# EAGLE design PowerModule_Testboard (EAGLE 9.6.2)
Assembly variants: DVT
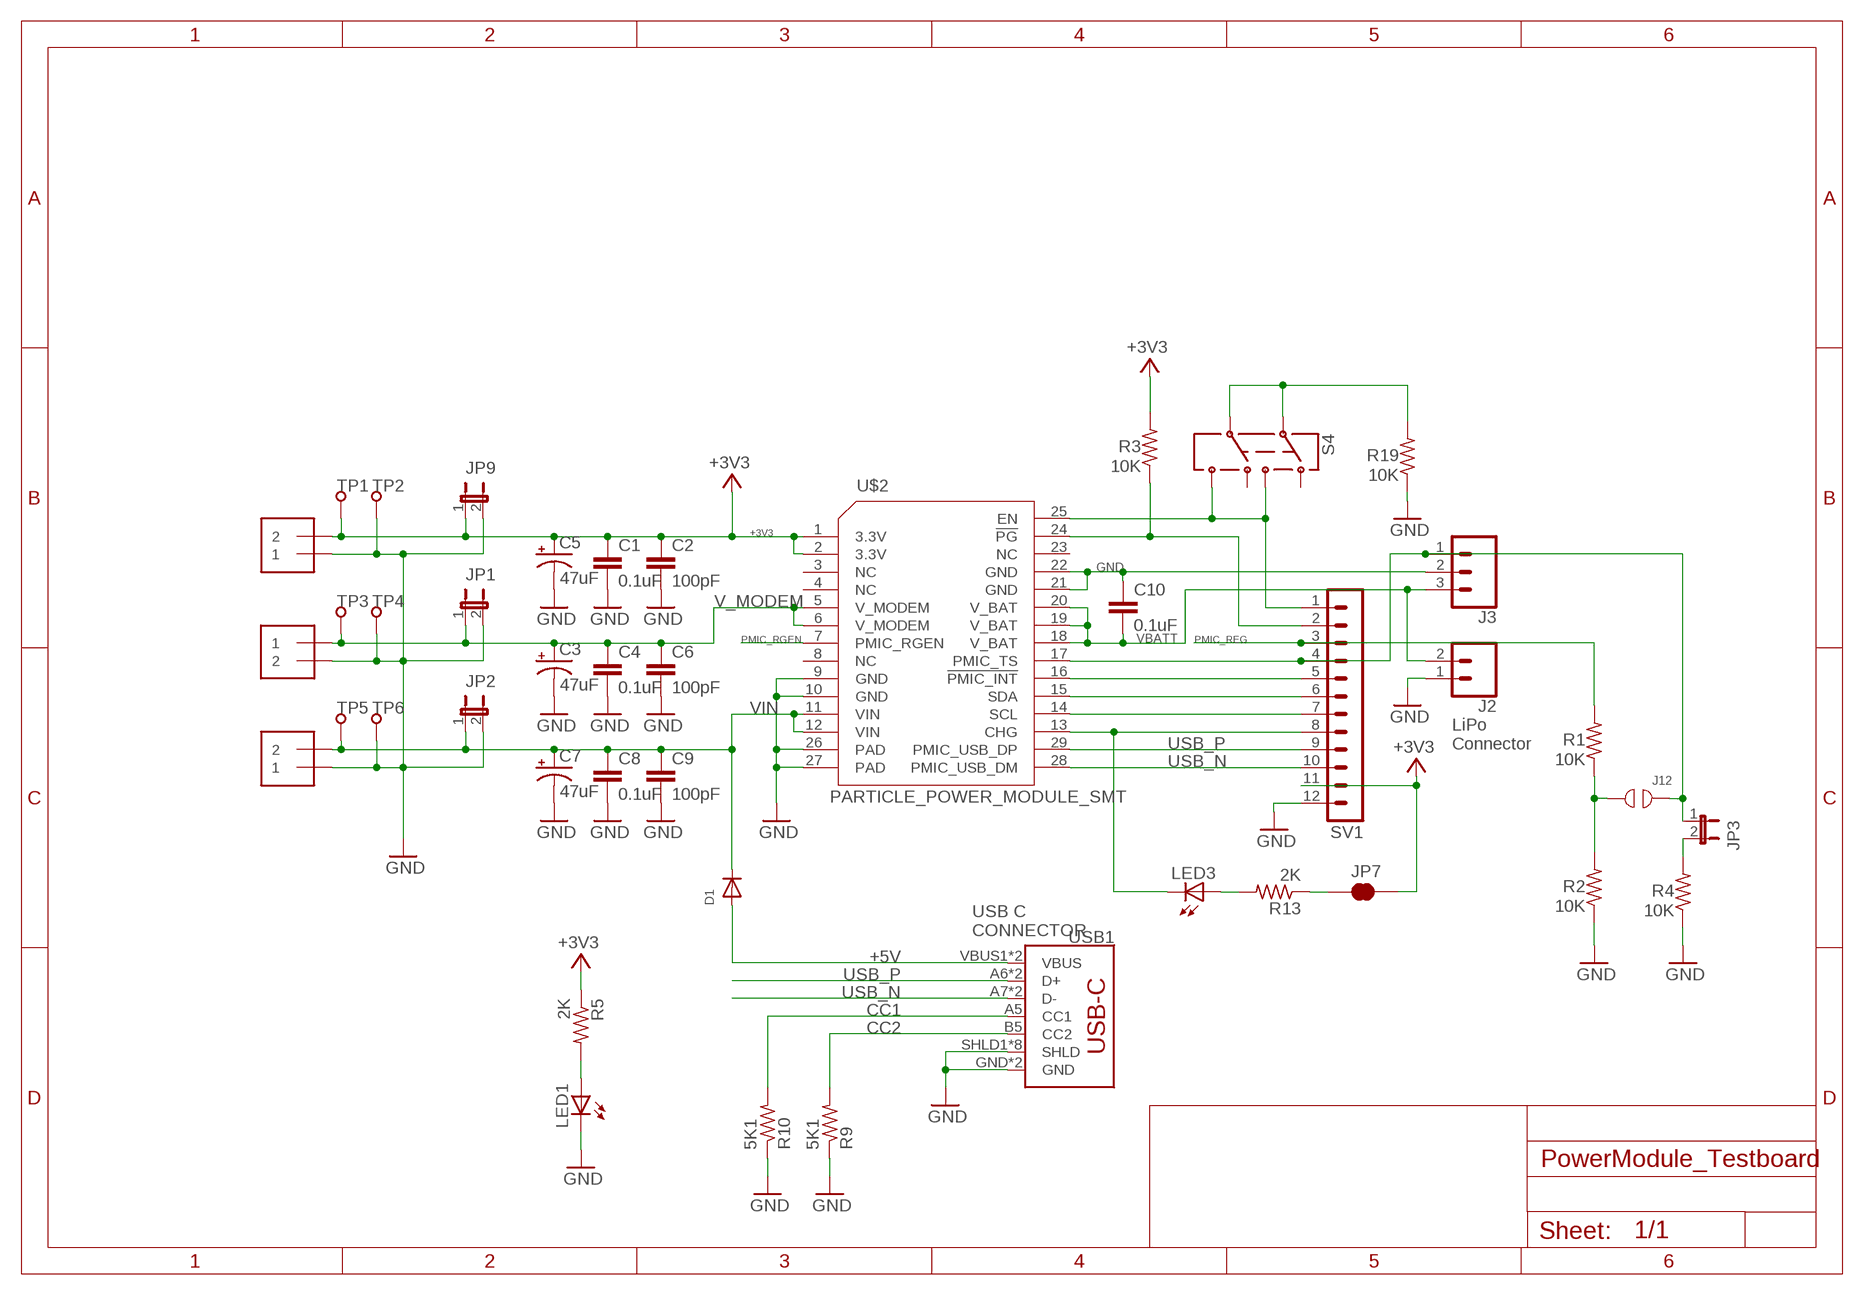
[diagram p0: schematic, sheet 1]

## Parts
C1  0.1uF  0.1UF-0603-25V-5%  [0603]
C2  100pF  0.1UF-0603-25V-5%  [0603]
C3  47uF  100UF-POLAR-10X10.5-63V-20%  [NIC_10X10.5_CAP]
C4  0.1uF  0.1UF-0603-25V-5%  [0603]
C5  47uF  100UF-POLAR-10X10.5-63V-20%  [NIC_10X10.5_CAP]
C6  100pF  0.1UF-0603-25V-5%  [0603]
C7  47uF  100UF-POLAR-10X10.5-63V-20%  [NIC_10X10.5_CAP]
C8  0.1uF  0.1UF-0603-25V-5%  [0603]
C9  100pF  0.1UF-0603-25V-5%  [0603]
C10  0.1uF  0.1UF-0603-25V-5%  [0603]
D1  DIODE_SOD-123FL  [SOD-123FL]
J1  1X2-3.5MM  [1X2-3.5MM]
J2  CONN_02-JST-2MM-SMT  [JST-2-SMD@2]
J3  CONN_03JST-SMD-VERT  [JST-3-SMD-VERT]
J4  1X2-3.5MM  [1X2-3.5MM]
J5  1X2-3.5MM  [1X2-3.5MM]
J12  TP_OPEN  [TP_OPEN]
JP1  JUMPER2  [JUMPER2]
JP2  JUMPER2  [JUMPER2]
JP3  JUMPER2  [JUMPER2]
JP7  JUMPER-SMT_2_NC_TRACE_NO-SILK  [SMT-JUMPER_2_NC_TRACE_NO-SILK]
JP9  JUMPER2  [JUMPER2]
LED1  LEDCHIP-LED0603  [CHIP-LED0603]
LED3  LEDCHIP-LED0603  [CHIP-LED0603]
R1  10K  RES_100K_0603  [R0603_P]
R2  10K  RES_100K_0603  [R0603_P]
R3  10K  RES_100K_0603  [R0603_P]
R4  10K  RES_100K_0603  [R0603_P]
R5  2K  RES_2K2_0603  [R0603_P]
R9  5K1  RES_0603  [R0603_P]
R10  5K1  RES_0603  [R0603_P]
R13  2K  RES_2K2_0603  [R0603_P]
R19  10K  RES_100K_0603  [R0603_P]
S4  SWITCH-DPDT  [SWITCH-2.5X3.2-6]
SV1  MA12-1  [MA12-1]
TP1  TP-S2751-46R  [S2751-46R]
TP2  TP-S2751-46R  [S2751-46R]
TP3  TP-S2751-46R  [S2751-46R]
TP4  TP-S2751-46R  [S2751-46R]
TP5  TP-S2751-46R  [S2751-46R]
TP6  TP-S2751-46R  [S2751-46R]
U$2  PARTICLE_POWER_MODULE_SMT  [PARTICLE_POWER_MODULE_SMT]
USB1  USB_C16PIN  [USB-C-16P]

## Nets
+3V3: C1.1 C2.1 C5.+ J4.2 JP7.1 JP9.1 R3.2 R5.1 SV1.11 TP1.1(TP) U$2.1(3.3V) U$2.2(3.3V)
+5V: D1.A USB1.VBUS1(VBUS) USB1.VBUS2(VBUS)
CC1: R10.2 USB1.A5(CC1)
CC2: R9.2 USB1.B5(CC2)
GND: C1.2 C2.2 C3.- C4.2 C5.- C6.2 C7.- C8.2 C9.2 C10.1 J1.2 J2.1 J3.2 J4.1 J5.1 JP1.2 JP2.2 JP9.2 LED1.C R2.1 R4.1 R9.1 R10.1 R19.1 SV1.12 TP2.1(TP) TP4.1(TP) TP6.1(TP) U$2.9(GND) U$2.10(GND) U$2.21(GND) U$2.22(GND) U$2.26(PAD) U$2.27(PAD) USB1.GND USB1.GND2(GND) USB1.SHLD1(SHLD) USB1.SHLD2(SHLD) USB1.SHLD3(SHLD) USB1.SHLD4(SHLD) USB1.SHLD5(SHLD) USB1.SHLD6(SHLD) USB1.SHLD7(SHLD) USB1.SHLD8(SHLD)
N$1: JP7.2 R13.1
N$2: R19.2 S4.2 S4.5
N$3: J12.1 R1.1 R2.2
N$4: R3.1 SV1.2 U$2.24(!PG)
N$5: J3.1 J12.2 JP3.1 SV1.4 U$2.17(PMIC_TS)
N$6: SV1.5 U$2.16(!PMIC_INT)
N$7: SV1.6 U$2.15(SDA)
N$8: SV1.7 U$2.14(SCL)
N$9: JP3.2 R4.2
N$11: LED3.C SV1.8 U$2.13(CHG)
N$12: LED3.A R13.2
N$13: S4.3 S4.6 SV1.1 U$2.25(EN)
N$15: LED1.A R5.2
PMIC_REG: R1.2 SV1.3
PMIC_RGEN: U$2.7(PMIC_RGEN)
USB_N [usb]: SV1.10 U$2.28(PMIC_USB_DM) USB1.A7(D-) USB1.B7(D-)
USB_P [usb]: SV1.9 U$2.29(PMIC_USB_DP) USB1.A6(D+) USB1.B6(D+)
V_MODEM: C3.+ C4.1 C6.1 J1.1 JP1.1 TP3.1(TP) U$2.5(V_MODEM) U$2.6(V_MODEM)
VBATT: C10.2 J2.2 J3.3 U$2.18(V_BAT) U$2.19(V_BAT) U$2.20(V_BAT)
VIN: C7.+ C8.1 C9.1 D1.C J5.2 JP2.1 TP5.1(TP) U$2.11(VIN) U$2.12(VIN)
Unconnected: S4.1 S4.4 U$2.3(NC) U$2.4(NC) U$2.8(NC) U$2.23(NC)

## Notes on the sheet
- LiPo
  Connector
- USB C
  CONNECTOR

## Library data of the parts
C1 C4 C8 C10 = SparkFun-Capacitors:0.1UF: 0.1µF ceramic capacitors A capacitor is a passive two-terminal electrical component used to store electrical energy temporarily in an electric field.; PROD_ID: CAP-08604
C2 C6 C9 = SparkFun-Capacitors:0.1UF: 0.1µF ceramic capacitors A capacitor is a passive two-terminal electrical component used to store electrical energy temporarily in an electric field.; PROD_ID: CAP-08604; VALUE: 0.1uF
C3 C5 C7 = particle-studios:100UF-POLAR: 100µF polarized capacitors A capacitor is a passive two-terminal electrical component used to store electrical energy temporarily in an electric field.; PROD_ID: CAP-08362; VALUE: 100uF
D1 = particle-studios:DIODE: Diode SMADIODE - SMA Surface Mount Package 20V 1A Schottky Diode Digikey: 641-1014-6-ND DO-1N4148 - Through Hole Small Current Diode SOD-123 20V 1 A (.5mV Vf) Schottky Diode - Digikey: MBRX120TPMSCT-ND SOD-323 10V 570mA (.38mV Vf, 3ns) Schottky Diode - Digikey: ZLLS410CT-ND SOD-523 30V 30mA Schottky Diode (RB751S-40TE61) - Digikey: RB751S-40TE61CT-ND SOT23-R/W - SOT23 Package (R = Solder Paste/Reflow Ovens, W = Hand-Soldering) BAT54Film 40V 300mA - Digikey: 497-7162-1-ND
J1 J4 J5 = adafruit:1X2: 3.5mm Terminal block http://www.ladyada.net/library/pcb/eaglelibrary.html
J2 = SparkFun-Connectors:CONN_02: Multi connection point. Often used as Generic Header-pin footprint for 0.1 inch spaced/style header connections On any of the 0.1 inch spaced packages, you can populate with these: Break Away Headers - Straight <https://www.sparkfun.com/products/116> (PRT-00116) Break Away Male Headers - Right Angle <https://www.sparkfun.com/products/553> (PRT-00553) Female Headers <https://www.sparkfun.com/products/115> (PRT-00115) Break Away Headers - Machine Pin <https://www.sparkfun.com/products/117> (PRT-00117) Break Away Female Headers - Swiss Machine Pin <https://www.sparkfun.com/products/743> (PRT-00743) For SCREWTERMINALS and SPRING TERMINALS visit here: Screw Terimnals on SparkFun.com <https://www.sparkfun.com/search/results?term=Screw+Terminals> (5mm/3.5mm/2.54mm spacing) This device is also useful as a general connection point to wire up your design to another part of your project. Our various solder wires solder well into these plated through hole pads. Hook-Up Wire - Assortment (Stranded, 22 AWG) <https://www.sparkfun.com/products/11375> (PRT-11375) Hook-Up Wire - Assortment (Solid Core, 22 AWG) <https://www.sparkfun.com/products/11367> (PRT-11367) View the entire wire category on our website here <https://www.sparkfun.com/categories/141> Special notes: Molex polarized connector foot print use with: PRT-08233 with associated crimp pins and housings. 2.54_SCREWTERM for use with PRT-10571. 3.5mm Screw Terminal footprints for PRT-08084 5mm Screw Terminal footprints for use with PRT-08432; PROD_ID: CONN-11443
J3 = particle-studios:CONN_03: Multi connection point. Often used as Generic Header-pin footprint for 0.1 inch spaced/style header connections On any of the 0.1 inch spaced packages, you can populate with these: Break Away Headers - Straight <https://www.sparkfun.com/products/116> (PRT-00116) Break Away Male Headers - Right Angle <https://www.sparkfun.com/products/553> (PRT-00553) Female Headers <https://www.sparkfun.com/products/115> (PRT-00115) Break Away Headers - Machine Pin <https://www.sparkfun.com/products/117> (PRT-00117) Break Away Female Headers - Swiss Machine Pin <https://www.sparkfun.com/products/743> (PRT-00743) Stackable Header - 3 Pin (Female, 0.1") <https://www.sparkfun.com/products/13875> (PRT-13875) For SCREWTERMINALS and SPRING TERMINALS visit here: Screw Terimnals on SparkFun.com <https://www.sparkfun.com/search/results?term=Screw+Terminals> (5mm/3.5mm/2.54mm spacing) This device is also useful as a general connection point to wire up your design to another part of your project. Our various solder wires solder well into these plated through hole pads. Hook-Up Wire - Assortment (Stranded, 22 AWG) <https://www.sparkfun.com/products/11375> (PRT-11375) Hook-Up Wire - Assortment (Solid Core, 22 AWG) <https://www.sparkfun.com/products/11367> (PRT-11367) View the entire wire category on our website here <https://www.sparkfun.com/categories/141> Special notes: Molex polarized connector foot print use with SKU : PRT-08232 with associated crimp pins and housings.
J12 = particle SZ:TP_OPEN
JP1-JP3 JP9 = microbuilder:JUMPER2: JUMPER - 2 Pins
JP7 = SparkFun-Jumpers:JUMPER-SMT_2_NC_TRACE: Normally closed trace jumper This jumper has a trace between two pads so it's normally closed (NC). Use a razor knife to open the connection. For best results follow the IPC guidelines for cutting traces: Cutout at least 0.063 mm (0.005 in). Remove all loose material to clean up the cut area. Seal the cut with an approved epoxy. Reapply solder to reclose the connection.
LED1 LED3 = adafruit:LED: LED OSRAM: - CHIPLED LG R971, LG N971, LY N971, LG Q971, LY Q971, LO R971, LY R971 LH N974, LH R974 LS Q976, LO Q976, LY Q976 LO Q996 - Hyper CHIPLED LW Q18S LB Q993, LB Q99A, LB R99A - SideLED LS A670, LO A670, LY A670, LG A670, LP A670 LB A673, LV A673, LT A673, LW A673 LH A674 LY A675 LS A676, LA A676, LO A676, LY A676, LW A676 LS A679, LY A679, LG A679 - Hyper Micro SIDELED® LS Y876, LA Y876, LO Y876, LY Y876 LT Y87S - SmartLED LW L88C, LW L88S LB L89C, LB L89S, LG L890 LS L89K, LO L89K, LY L89K LS L896, LA L896, LO L896, LY L896 - TOPLED LS T670, LO T670, LY T670, LG T670, LP T670 LSG T670, LSP T670, LSY T670, LOP T670, LYG T670 LG T671, LOG T671, LSG T671 LB T673, LV T673, LT T673, LW T673 LH T674 LS T676, LA T676, LO T676, LY T676, LB T676, LH T676, LSB T676, LW T676 LB T67C, LV T67C, LT T67C, LS T67K, LO T67K, LY T67K, LW E67C LS E67B, LA E67B, LO E67B, LY E67B, LB E67C, LV E67C, LT E67C LW T67C LS T679, LY T679, LG T679 LS T770, LO T770, LY T770, LG T770, LP T770 LB T773, LV T773, LT T773, LW T773 LH T774 LS E675, LA E675, LY E675, LS T675 LS T776, LA T776, LO T776, LY T776, LB T776 LHGB T686 LT T68C, LB T68C - Hyper Mini TOPLED® LB M676 - Mini TOPLED Santana® LG M470 LS M47K, LO M47K, LY M47K Source: http://www.osram.convergy.de/
R1-R4 R19 = particle-studios:RES_: Particle Resistors; DESP: RES SMD 100K OHM 1% 1/10W 0603; VALUE: 100K
R5 R13 = particle-studios:RES_: Particle Resistors; DESP: RES SMD 2K2 OHM 1% 1/10W 0603; VALUE: 2K2
R9 R10 = particle-studios:RES_: Particle Resistors
S4 = SparkFun-Retired:SWITCH-DPDT: DPDT Version of the COM-00597
SV1 = con-lstb:MA12-1: PIN HEADER; OC_FARNELL: unknown; OC_NEWARK: unknown
TP1-TP6 = particle-studios:TP
U$2 = particle-studios:PARTICLE_POWER_MODULE_SMT
USB1 = SparkFun-Connectors:USB_C: USB Type C 16Pin Connector Super Speed pins not available on the 16-pin purely SMD connector so this part is best for USB 2.0 implementations. D1 and D2 are tied together enabling D+/- no matter which way the cable is plugged into the connector. The two channel configuration pins (CC1/2) are exposed. These are normally connected to ground via 5.1k resistors but can be reconfigured for high current/high power applications.; PROD_ID: CONN-14122

## Net classes
1 usb: width 0.2 mm, clearance 0.2 mm to class 0, clearance 0.2 mm

## Board
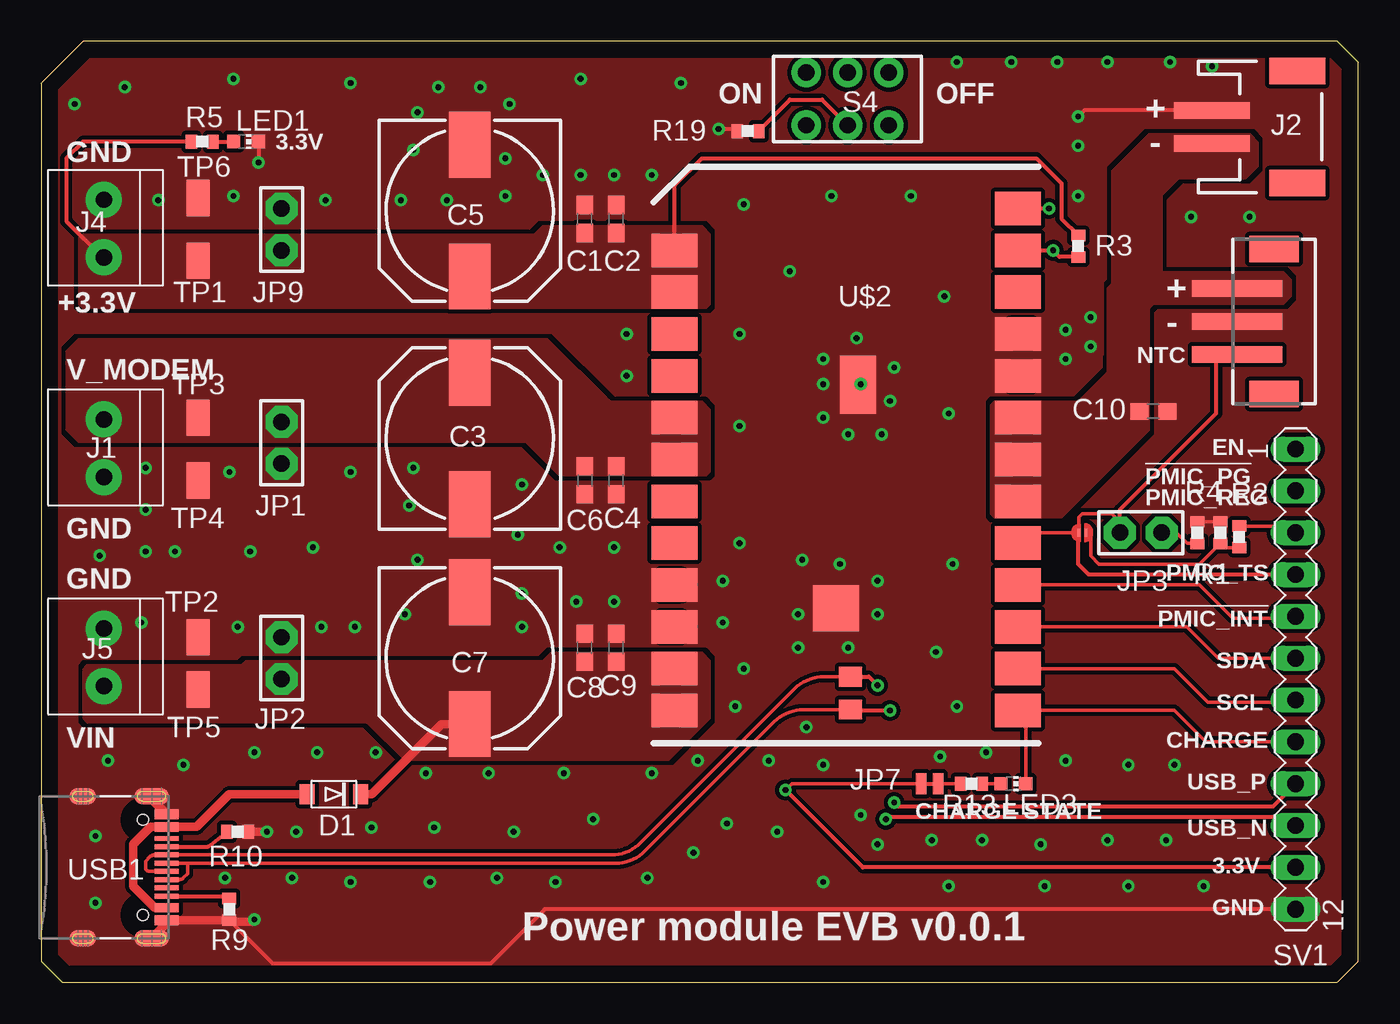
[diagram p1: board, top side]
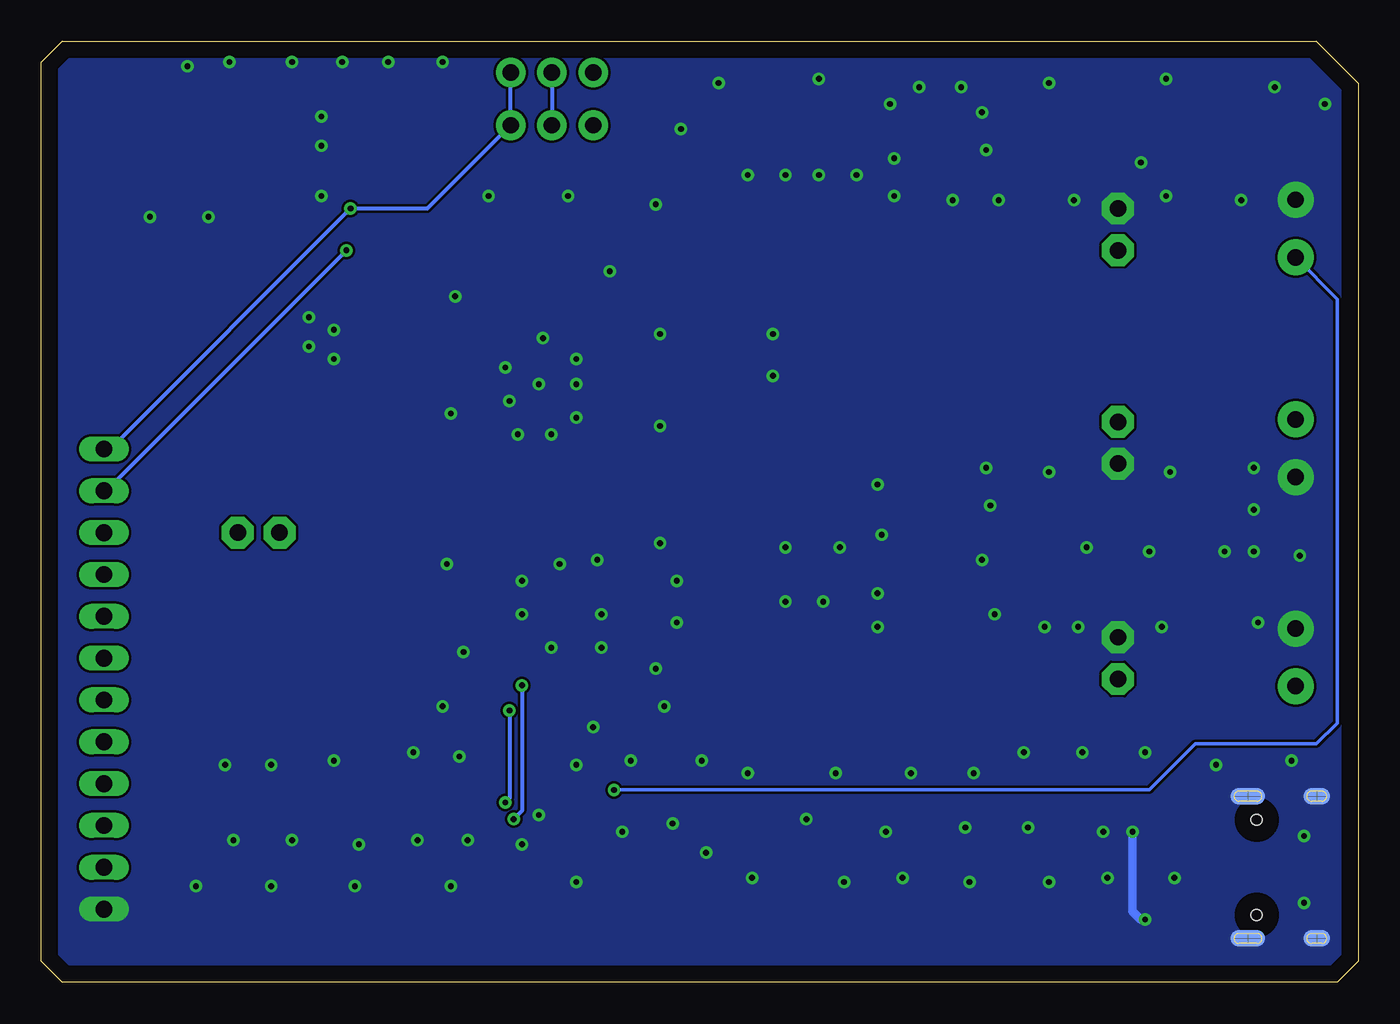
[diagram p2: board, bottom side, seen from below]

Size 80.01 x 57.15 mm. Coordinates in mm from the lower left corner, seen from the top.
Outline: 1.27,0 78.74,0 80.01,1.27 80.01,55.88 78.74,57.15 2.54,57.15 0,54.61 0,1.27 1.27,0
Copper layers (1*16): Top 0.035mm / dielectric 1.5mm / Bottom 0.035mm
Design rules "default *": minimum track width 6mil, minimum drill 0.35mm, track to track 6mil, track to pad 6mil, pad to pad 6mil, via to via 6mil, smd to smd 6mil, copper to edge 40mil, drill to drill 6mil, minimum pad ring 10mil, minimum via ring 8mil, stop-mask expansion 4mil, vias tented up to drill 14mil, thermal gap 10mil

### Footprints (pad centres in the part's own frame; a part is rotated, then mirrored left to right if it is on the bottom)
0603 = smd 1.1 x 1: 1 -0.85,0; 2 0.85,0
NIC_10X10.5_CAP = smd 4 x 2.5: + 4,0; - -4,0
SOD-123FL = smd 0.91 x 1.22: A 1.637,0; C -1.637,0
1X2-3.5MM = drill 1 pad 2.184: 1 1.8,0; 2 -1.7,0
JST-2-SMD@2 = smd 1 x 4.6: 1 -1,-3.7; 2 1,-3.7 | smd 1.6 x 3.4: NC1 -3.4,1.5; NC2 3.4,1.5
JST-3-SMD-VERT = smd 1 x 5.5: 1 -2,0; 2 0,0; 3 2,0 | smd 1.6 x 3: PAD1 -4.4,-2.25; PAD2 4.4,-2.25
TP_OPEN = smd 0.2 x 0.5: 1 -0.21,0; 2 0.21,0
JUMPER2 = drill 1 pad 1.93 octagon: 1 2.54,0; 2 0,0
SMT-JUMPER_2_NC_TRACE_NO-SILK = smd 0.635 x 1.27: 1 -0.508,0; 2 0.508,0
CHIP-LED0603 = smd 0.8 x 0.8: A 0,-0.75; C 0,0.75
R0603_P = smd 0.7 x 0.85: 1 -0.65,0; 2 0.65,0
SWITCH-2.5X3.2-6 = drill 1 pad 1.8: 1 0,0; 2 0,2.5; 3 0,5; 4 3.2,0; 5 3.2,2.5; 6 3.2,5
MA12-1 = drill 1.016 long: 1 -13.97,0; 2 -11.43,0; 3 -8.89,0; 4 -6.35,0; 5 -3.81,0; 6 -1.27,0; 7 1.27,0; 8 3.81,0; 9 6.35,0; 10 8.89,0; 11 11.43,0; 12 13.97,0
S2751-46R = smd 2.2 x 1.4: 1 0,0
PARTICLE_POWER_MODULE_SMT = smd 2.032 x 2.794: 1 5.08,1.016; 2 7.62,1.016; 3 10.16,1.016; 4 12.7,1.016; 5 15.24,1.016; 6 17.78,1.016; 7 20.32,1.016; 8 22.86,1.016; 9 25.4,1.016; 10 27.94,1.016; 11 30.48,1.016; 12 33.02,1.016; 13 33.02,21.869; 14 30.48,21.869; 15 27.94,21.869; 16 25.4,21.869; 17 22.86,21.869; 18 20.32,21.869; 19 17.78,21.869; 20 15.24,21.869; 21 12.7,21.869; 22 10.16,21.869; 23 7.62,21.869; 24 5.08,21.869; 25 2.54,21.869 | smd 3.5 x 2.2: 26 13.239,12.153 | smd 2.8 x 2.8: 27 26.803,10.82 | smd 1.2 x 1.4: 28 30.969,11.698; 29 32.969,11.698
USB-C-16P = smd 0.3 x 1.45: A5 -1.25,0; A6 -0.25,0; A7 0.25,0; A8 1.25,0; B5 1.75,0; B6 0.75,0; B7 -0.75,0; B8 -1.75,0 | smd 0.6 x 1.45: GND -3.225,0; GND2 3.225,0 | smd 1 x 2.1: SHLD1 -4.32,-0.915; SHLD2 4.32,-0.915 | smd 1 x 2.1 bottom: SHLD3 -4.32,-0.915; SHLD4 4.32,-0.915 | smd 1 x 1.6: SHLD5 -4.32,-5.095; SHLD8 4.32,-5.095 | smd 1 x 1.6 bottom: SHLD6 -4.32,-5.095; SHLD7 4.32,-5.095 | smd 0.55 x 1.45: VBUS1 -2.45,0; VBUS2 2.45,0 | hole 0.65: -2.89,-1.445; 2.89,-1.445

### Placement (x,y rotation side)
C1  33.02,46.35 90 top
C2  34.92,46.35 90 top
C3  26.04,33.02 90 top
C4  34.92,30.48 270 top
C5  26.04,46.86 270 top
C6  33.02,30.48 270 top
C7  26.04,19.68 270 top
C8  33.02,20.32 90 top
C9  34.92,20.32 90 top
C10  67.56,34.67 180 top
D1  17.78,11.43 180 top
J1  3.81,32.38 90 top
J2  74.8,51.94 270 top
J3  72.64,40.13 90 top
J4  3.81,45.72 90 top
J5  3.81,19.68 90 top
J12  63.25,27.3 180 top
JP1  14.61,31.5 90 top
JP2  14.61,20.95 270 top
JP3  68.07,27.3 180 top
JP7  53.98,12.06 0 top
JP9  14.61,46.99 270 top
LED1  12.45,51.05 270 top
LED3  59.05,12.06 270 top
R1  72.77,27.05 90 top
R2  71.63,27.3 270 top
R3  62.99,44.7 90 top
R4  70.23,27.3 270 top
R5  9.78,51.05 0 top
R9  11.43,4.45 90 top
R10  11.94,9.14 180 top
R13  56.52,12.06 0 top
R19  42.93,51.69 0 top
S4  46.48,55.24 270 top
SV1  76.2,18.41 270 top
TP1  9.53,43.81 90 top
TP2  9.53,20.95 90 top
TP3  9.53,34.29 90 top
TP4  9.53,30.48 270 top
TP5  9.53,17.78 90 top
TP6  9.53,47.62 270 top
U$2  37.47,49.53 270 top
USB1  7.62,6.99 270 top

### Tracks (layer width: path | path; a pad name or v marks a point on that pad's centre or on a via)
+3V3  (via drill 0.35)
  Top 0.2: JP7.1 45.59,12.06 v45.21,11.68
  Top 0.254: U$2.1 38.48,48.39 40.13,50.04 60.45,50.04 61.98,48.51 61.98,46.37 R3.2 | SV1.11 49.91,6.99 v45.21,11.68 | R5.1 2.54,51.05 1.52,50.04 1.52,46.23 3.73,44.02 J4.2
  Bottom 0.2: v45.21,11.68 12.7,11.68 9.91,14.48 2.54,14.48 1.27,15.75 1.27,41.48 J4.2
  pour Top (no thermals): 2.54,45.47 29.97,45.47 30.48,45.97 40.13,45.97 40.64,45.47 40.64,41.15 40.39,40.89 2.54,40.89 2.29,41.15 2.29,45.21
+5V
  Top 0.508: USB1.VBUS2 6.89,4.54 5.59,5.84 5.59,8.38 6.64,9.44 USB1.VBUS1 9.44,9.44 11.43,11.43 D1.A
CC1
  Top 0.254: USB1.A5 10.15,8.23 R10.2
CC2
  Top 0.254: USB1.B5 11.29,5.24 R9.2
GND  (via drill 0.35)
  Top 0.2: R4.1 R2.1
  Top 0.254: J2.1 63.36,52.94 v62.99,52.58 | SV1.12 30.61,4.45 27.3,1.14 14.08,1.14 11.55,3.67 R9.1 | R19.1 42.32,51.82 v41.15,51.82 | LED1.C v13.21,49.78
  Top 0.508: R10.1 v13.72,9.14 | v12.95,3.81 12.82,3.67 11.55,3.67 | R9.1 11.39,3.76 USB1.GND2 7.62,3.58 USB1.SHLD4 | USB1.GND 6.71,11.12 USB1.SHLD3
  Bottom 0.508: v13.72,9.14 13.72,4.32 13.21,3.81 v12.95,3.81
  other vias: 47.5,37.85 47.5,36.32 47.5,34.29 49.02,33.27 51.05,33.27 51.56,35.31 51.82,37.34 49.53,39.12 49.78,36.32 50.8,22.35 50.8,24.38 48.51,25.4 46.23,25.65 45.97,22.35 45.97,20.32 49.02,20.32 42.42,39.37 42.42,33.78 42.42,26.67 42.67,19.05 55.63,16.76 55.37,25.4 55.12,34.54 54.86,41.66 42.67,47.24 48.01,47.75 52.83,47.75 3.56,25.91 8.13,26.16 12.7,26.16 16.51,26.42 22.61,31.24 22.35,28.96 22.86,25.65 22.1,22.35 29.21,30.23 28.96,27.18 29.21,23.62 29.21,21.59 31.5,26.42 34.8,26.42 32.51,23.11 34.8,23.11 41.4,24.38 41.4,21.84 6.1,21.84 11.94,21.59 17.02,21.59 19.05,21.59 7.11,47.5 11.68,47.75 17.27,47.5 21.84,47.5 24.64,47.5 28.19,47.75 30.48,49.02 32.77,49.02 34.8,49.02 37.08,49.02 18.8,30.99 11.43,30.99 3.3,8.89 3.3,4.83 11.18,6.35 15.24,6.35 18.8,6.1 23.62,6.1 27.69,6.35 31.24,6.1 36.83,6.35 39.62,7.87 41.66,9.65 15.49,9.14 20.07,9.4 23.88,9.4 28.7,9.14 33.53,9.91 42.16,16.76 39.88,13.46 37.08,12.7 31.75,12.7 27.18,12.7 23.37,12.7 12.95,13.97 16.76,13.97 20.32,13.97 46.48,15.49 44.2,13.46 54.61,13.72 57.4,13.97 62.23,13.46 66.04,13.21 68.83,13.21 68.33,8.64 64.77,8.64 60.71,8.38 57.15,8.64 54.1,8.64 49.78,10.16 50.8,8.38 47.5,13.21 44.7,9.14 47.5,6.1 55.12,5.84 60.96,5.84 66.04,5.84 70.61,5.84 62.23,39.62 62.23,37.85 63.75,40.39 63.75,38.61 62.99,50.8 62.99,47.75 69.85,46.48 73.41,46.48 55.63,55.88 58.93,55.88 61.72,55.88 64.77,55.88 68.58,55.88 71.12,55.63 22.86,52.83 22.61,50.55 28.45,53.34 28.19,50.04 24.13,54.36 26.67,54.36 5.08,54.36 11.68,54.86 18.8,54.61 32.77,54.86 38.86,54.61 2.03,53.34 6.35,31.24 6.35,28.7 6.35,26.16 8.64,13.21 4.06,13.46 35.56,39.37 35.56,36.83 45.47,43.18 54.36,20.07
  pour Top (no thermals): 57.91,40.39 61.98,40.39 63.75,42.16 63.75,54.36 64.26,54.86 72.64,54.86 73.91,53.59 73.91,52.32 66.55,52.32 64.52,50.29 64.52,38.1 62.23,35.81 57.66,35.81 57.66,40.13
  pour Top (isolate 0.254, rank 2, no thermals): 2.54,57.15 78.74,57.15 80.01,55.88 80.01,1.27 78.74,0 1.27,0 0,1.27 0,54.61
  pour Bottom (isolate 0.127, rank 3, no thermals): 2.54,57.15 78.74,57.15 80.01,55.88 80.01,1.27 78.74,0 1.27,0 0,1.27 0,55.88 1.27,57.15
N$1
  Top 0.2: R13.1 JP7.2
N$2
  Top 0.254: R19.2 45.48,53.59 47.43,53.59 S4.5
  Bottom 0.254: S4.2 S4.5
N$3
  Top 0.2: R1.1 71.88,26.4 R2.2 71.61,26.66 70.36,25.4 64.26,25.4 63.75,25.91 63.75,27.01 J12.1
N$4  (via drill 0.35)
  Top 0.254: U$2.24 v61.47,44.45 61.86,44.05 R3.1
  Bottom 0.254: v61.47,44.45 76.07,29.84 SV1.2
N$5
  Top 0.2: U$2.17 59.97,27.3 62.99,27.3 J12.2 63.04,28.24 63.25,28.45 65.02,28.45 65.53,27.94 JP3.1
  Top 0.254: SV1.4 63.63,24.77 62.99,25.4 62.99,27.3 | JP3.1 65.53,28.7 71.37,34.54 71.37,38.1 71.41,38.13 J3.1
N$6
  Top 0.2: U$2.16 70.36,24.13 72.39,22.1 76.07,22.1 SV1.5
N$7
  Top 0.2: U$2.15 69.6,21.59 71.5,19.68 SV1.6
N$8
  Top 0.2: U$2.14 68.83,19.05 70.87,17.02 76.07,17.02 SV1.7
N$9
  Top 0.2: JP3.2 68.96,27.3 69.61,26.66 R4.2
N$11
  Top 0.2: LED3.C 59.8,15.37 arc45 U$2.13 68.83,16.51 70.74,14.61 SV1.8
N$12
  Top 0.2: LED3.A R13.2
N$13  (via drill 0.35)
  Top 0.254: U$2.25 v61.21,46.99
  Bottom 0.254: SV1.1 75.82,32.38 v61.21,46.99 56.54,46.99 S4.6 S4.3
N$15
  Top 0.254: R5.2 LED1.A
PMIC_REG
  Top 0.2: R1.2 75.8,27.7 SV1.3
USB_N  (via drill 0.35)
  Top 0.2: U$2.28 47.55,18.56 arc45 45.76,17.82 36.42,8.48 arc-45 34.62,7.74 USB1.B7 6.88,7.74 arc45 6.6,7.62 6.35,7.37 6.35,6.86 arc45 6.65,6.74 USB1.A7
  Top 0.254: U$2.28 50.27,18.56 v50.8,18.03 | v51.31,9.91 51.44,10.03 75.69,10.03 SV1.10
  Bottom 0.254: v50.8,18.03 50.8,10.41 v51.31,9.91
USB_P  (via drill 0.35)
  Top 0.2: USB1.A6 8.89,7.24 | 8.89,7.24 34.88,7.24 arc45 36.68,7.98 44.52,15.82 arc-45 46.31,16.56 U$2.29 | USB1.B6 8.36,6.24 arc45 8.64,6.35 8.89,6.6 8.89,7.24
  Top 0.254: U$2.29 49.21,16.51 v51.56,16.51 | v51.82,10.92 52.07,10.67 74.8,10.67 SV1.9
  Bottom 0.254: v51.56,16.51 51.56,11.18 v51.82,10.92
V_MODEM
  pour Top (no thermals): 2.29,39.12 30.73,39.12 34.54,35.31 40.13,35.31 40.64,34.8 40.64,30.99 40.39,30.73 31.5,30.73 29.46,32.77 2.29,32.77 1.52,33.53 1.52,38.35
VBATT
  pour Top (no thermals): 57.91,35.31 62.99,35.31 64.77,37.08 64.77,42.16 65.79,43.18 75.44,43.18 75.95,42.67 75.95,41.66 75.44,41.15 67.56,41.15 67.31,40.89 67.31,33.53 61.98,28.19 57.91,28.19 57.66,28.45 57.66,35.05
  pour Top (no thermals): 65.02,41.66 65.02,49.28 66.8,51.05 67.31,51.56 73.41,51.56 73.91,51.05 73.91,50.04 73.91,49.53 73.15,48.77 69.09,48.77 68.07,47.75 68.07,47.5 68.07,43.18 66.55,41.66
VIN
  Top 0.508: D1.C 20.07,11.43 24.32,15.69 C7.+
  pour Top (no thermals): 2.79,19.3 12.19,19.3 12.45,19.56 30.48,19.56 30.99,20.07 40.13,20.07 40.64,19.56 40.64,16 38.1,13.46 22.1,13.46 19.81,15.75 2.79,15.75 2.54,16 2.54,19.05

### Text on the board
tPlace: ON | OFF | + | 3.3V | GND | - | +3.3V | + | - | NTC | V_MODEM | EN | !PMIC_PG | PMIC_REG | GND | GND | PMIC_TS | !PMIC_INT | SDA | SCL | VIN | CHARGE | USB_P | CHARGE STATE | USB_N | 3.3V | GND | Power module EVB v0.0.1